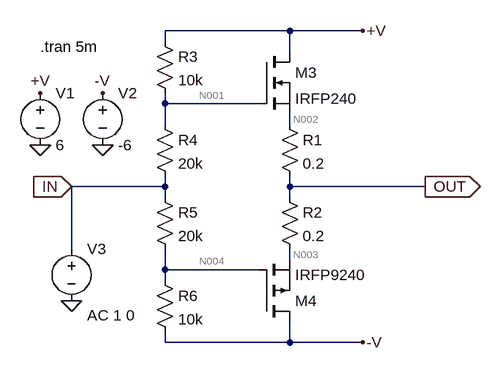
[diagram p0: schematic Circuit7_22.asc]
Circuit7_22.asc, the LTspice schematic file:
Version 4
SHEET 1 1092 680
WIRE 80 80 -112 80
WIRE 192 80 80 80
WIRE -112 96 -112 80
WIRE 80 112 80 80
WIRE -112 192 -112 176
WIRE 32 192 -112 192
WIRE -112 224 -112 192
WIRE 80 224 80 208
WIRE -112 320 -112 304
WIRE -112 320 -256 320
WIRE 80 320 80 304
WIRE 288 320 80 320
WIRE -112 336 -112 320
WIRE 80 336 80 320
WIRE -256 416 -256 320
WIRE 80 432 80 416
WIRE -112 448 -112 416
WIRE 32 448 -112 448
WIRE -112 464 -112 448
WIRE -112 560 -112 544
WIRE 80 560 80 528
WIRE 80 560 -112 560
WIRE 192 560 80 560
FLAG -304 256 0
FLAG -208 256 0
FLAG -256 496 0
FLAG 192 80 +V
FLAG -304 176 +V
FLAG 192 560 -V
FLAG -208 176 -V
FLAG -256 320 IN
IOPIN -256 320 In
FLAG 288 320 OUT
IOPIN 288 320 Out
SYMBOL res 64 208 R0
SYMATTR InstName R1
SYMATTR Value 0.2
SYMBOL res 64 320 R0
SYMATTR InstName R2
SYMATTR Value 0.2
SYMBOL res -128 80 R0
SYMATTR InstName R3
SYMATTR Value 10k
SYMBOL res -128 208 R0
SYMATTR InstName R4
SYMATTR Value 20k
SYMBOL res -128 448 R0
SYMATTR InstName R6
SYMATTR Value 10k
SYMBOL voltage -304 160 R0
SYMATTR InstName V1
SYMATTR Value 6
SYMBOL voltage -208 160 R0
SYMATTR InstName V2
SYMATTR Value -6
SYMBOL voltage -256 400 R0
WINDOW 3 24 96 Invisible 2
WINDOW 123 24 118 Left 2
SYMATTR Value SINE(0 1 1K)
SYMATTR Value2 AC 1 0
SYMATTR InstName V3
SYMBOL res -128 320 R0
SYMATTR InstName R5
SYMATTR Value 20k
SYMBOL nmos 32 112 R0
SYMATTR InstName M3
SYMATTR Value IRFP240
SYMBOL pmos 32 528 M180
SYMATTR InstName M4
SYMATTR Value IRFP9240
TEXT -304 104 Left 2 !.tran 5m

The netlist it stands for:
* Circuit7_22.asc
R1 N002 OUT 0.2
R2 OUT N003 0.2
R3 +V N001 10k
R4 N001 IN 20k
R6 N004 -V 10k
V1 +V 0 6
V2 -V 0 -6
V3 IN 0 SINE(0 1 1K) AC 1 0
R5 IN N004 20k
M3 +V N001 N002 N002 IRFP240
M4 -V N004 N003 N003 IRFP9240
.model NMOS NMOS
.model PMOS PMOS
.lib standard.mos
.tran 5m
.backanno
.end

* Results of the author's LTspice run, read from the files saved beside the schematic
* Operating Point, zero values left out:
*   V(n002) = -23.86 mV
*   V(out) = -27.73 mV
*   V(n003) = -31.59 mV
*   V(+v) = 6 V
*   V(n001) = 4 V
*   V(n004) = -4 V
*   V(-v) = -6 V
*   Id(M4) = -19.34 mA
*   Is(M4) = 19.34 mA
*   Id(M3) = 19.34 mA
*   Is(M3) = -19.34 mA
*   I(R5) = 200 µA
*   I(R6) = 200 µA
*   I(R4) = 200 µA
*   I(R3) = 200 µA
*   I(R2) = 19.34 mA
*   I(R1) = 19.34 mA
*   I(V2) = 19.54 mA
*   I(V1) = -19.54 mA
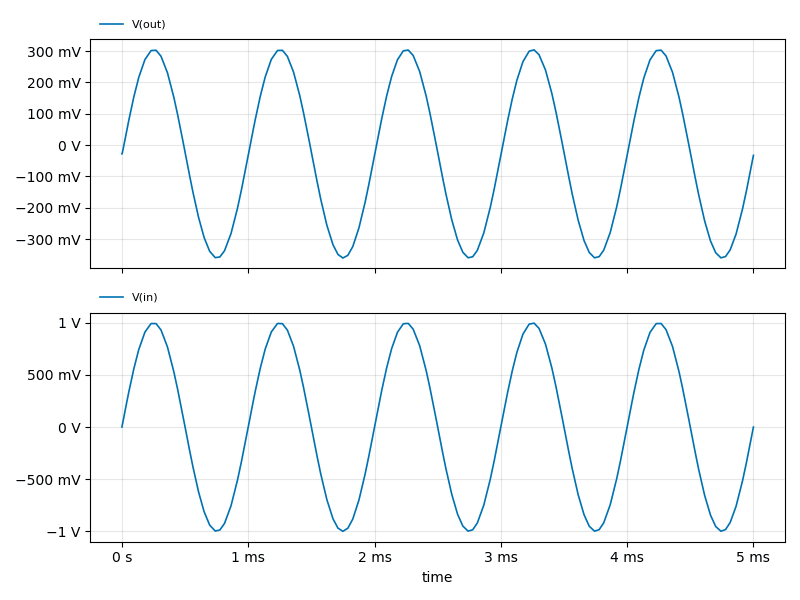
[diagram p1: Transient Analysis of Circuit7_22.asc, plotted from the saved traces]
* Transient Analysis, 1 run:
*   V(out): min -359.9 mV, max 303.7 mV, average -27.76 mV, rms 236 mV, last -32.71 mV
*   V(in): min -1 V, max 996.5 mV, average -102.5 µV, rms 705.6 mV, last 0 V